# Altium schematic sheet Keyboard.SchDoc
size 420 x 297 mm; DocumentNumber: KeyBoard
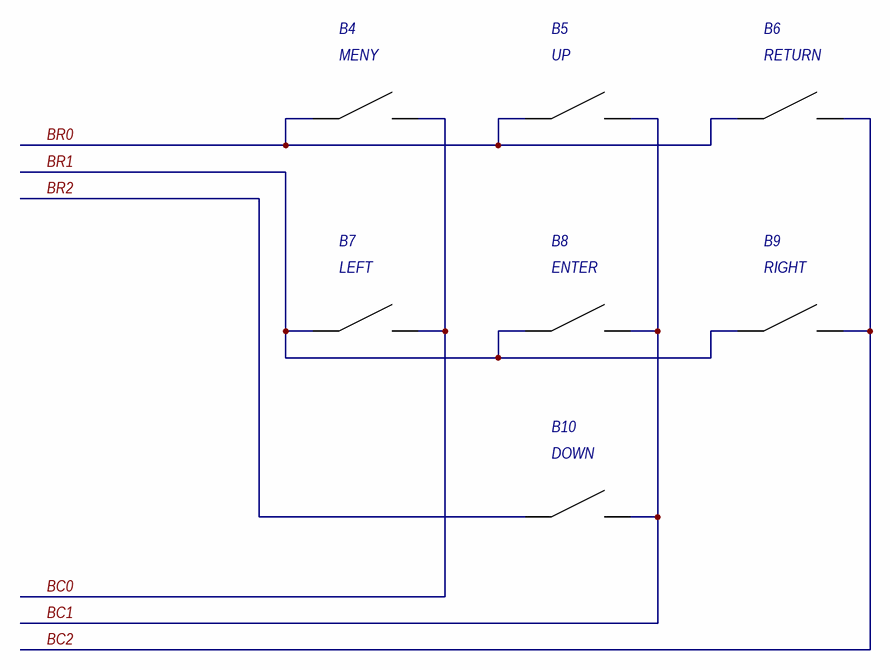
[diagram p0: Keyboard.SchDoc]

## Parts
B4  MENY  [BUTTON_DIP]
B5  UP  [BUTTON_DIP]
B6  RETURN  [BUTTON_DIP]
B7  LEFT  [BUTTON_DIP]
B8  ENTER  [BUTTON_DIP]
B9  RIGHT  [BUTTON_DIP]
B10  DOWN  [BUTTON_DIP]

## Nets
BC0: B4.2 B7.2
BC1: B5.2 B8.2 B10.2
BC2: B6.2 B9.2
BR0: B4.1 B5.1 B6.1
BR1: B7.1 B8.1 B9.1
BR2: B10.1

## Notes on the sheet
- Подп. и дата
- Инв. № дубл.
- Взам. инв. №
- Инв. № подл.
- Лист
- Изм.
- № докум.
- Подп.
- Дата
- Копировал
- Формат А3

## Library data of the parts
B4-B10 = BUTTON